# Altium schematic sheet Extra Analogue Inputs.SchDoc: Ravage - Extra Analogue Inputs
size A4; Address1: Drawn By:; Address2: Dan Visser; DocumentNumber: A; Revision: 0.1-alpha; SheetNumber: 7; SheetTotal: 16
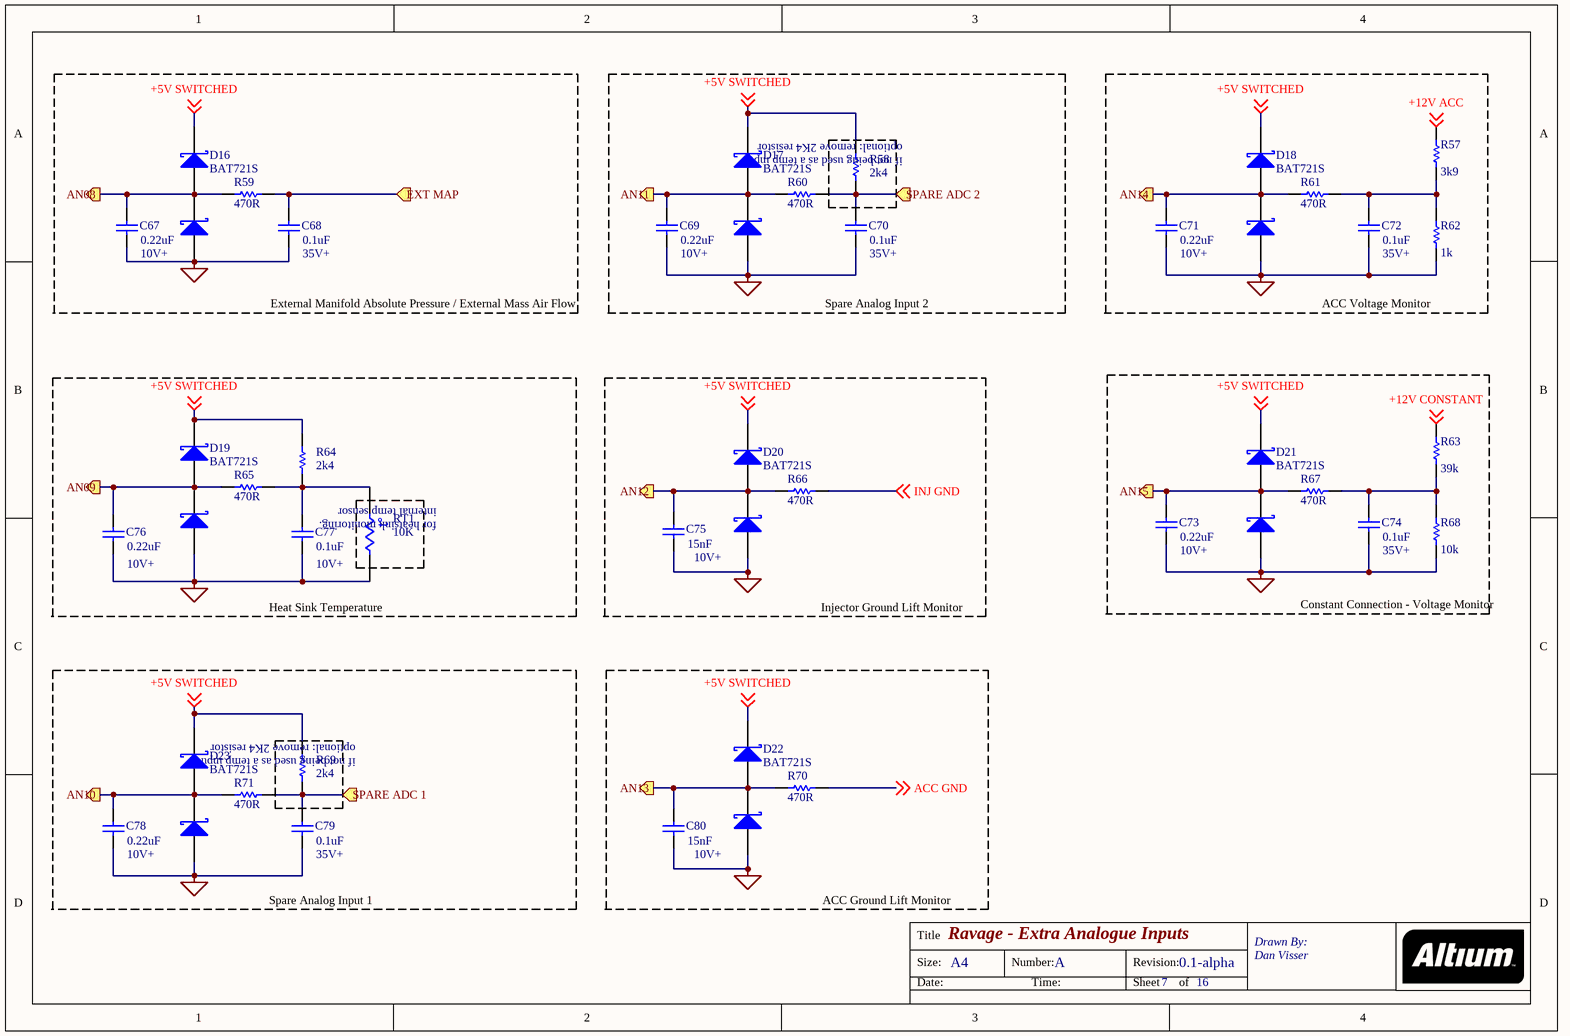
[diagram p0: Extra Analogue Inputs.SchDoc]

## Parts
C67  value 0.22uF  [RAD-0.3]
C68  value 0.1uF  [RAD-0.3]
C69  value 0.22uF  [RAD-0.3]
C70  value 0.1uF  [RAD-0.3]
C71  value 0.22uF  [RAD-0.3]
C72  value 0.1uF  [RAD-0.3]
C73  value 0.22uF  [RAD-0.3]
C74  value 0.1uF  [RAD-0.3]
C75  value 15nF  [RAD-0.3]
C76  value 0.22uF  [RAD-0.3]
C77  value 0.1uF  [RAD-0.3]
C78  value 0.22uF  [RAD-0.3]
C79  value 0.1uF  [RAD-0.3]
C80  value 15nF  [RAD-0.3]
D16  BAT721S
D17  BAT721S
D18  BAT721S
D19  BAT721S
D20  BAT721S
D21  BAT721S
D22  BAT721S
D23  BAT721S
R57  value 3k9  [AXIAL-0.3]
R58  value 2k4  [AXIAL-0.3]
R59  value 470R  [AXIAL-0.3]
R60  value 470R  [AXIAL-0.3]
R61  value 470R  [AXIAL-0.3]
R62  value 1k  [AXIAL-0.3]
R63  value 39k  [AXIAL-0.3]
R64  value 2k4  [AXIAL-0.3]
R65  value 470R  [AXIAL-0.3]
R66  value 470R  [AXIAL-0.3]
R67  value 470R  [AXIAL-0.3]
R68  value 10k  [AXIAL-0.3]
R69  value 2k4  [AXIAL-0.3]
R70  value 470R  [AXIAL-0.3]
R71  value 470R  [AXIAL-0.3]
RT1  10K  [6-0805_N]

## Ports
AN08 (out), AN09 (out), AN10 (out), AN11 (out), AN12 (out), AN13 (out), AN14 (out), AN15 (out), EXT MAP (in), SPARE ADC 1 (in), SPARE ADC 2 (in)

## Nets
NetC67_1: C67.1 C68.1 C69.1 C70.1 C71.1 C72.1 C73.1 C74.1 C75.1 C76.1 C77.1 C78.1 C79.1 C80.1 D16.1(A) D17.1(A) D18.1(A) D19.1(A) D20.1(A) D21.1(A) D22.1(A) D23.1(A) R62.1 R68.1 RT1.2
+5V SWITCHED: D16.2(K) D17.2(K) D18.2(K) D19.2(K) D20.2(K) D21.2(K) D22.2(K) D23.2(K) R58.1 R64.1 R69.1 ; off-sheet +5V SWITCHED
+12V ACC: R57.2 ; off-sheet +12V ACC
+12V CONSTANT: R63.2 ; off-sheet +12V CONSTANT
ACC GND: R70.2 ; off-sheet ACC GND
AN08: C67.2 D16.3(A2) R59.1 ; port AN08
AN09: C76.2 D19.3(A2) R65.1 ; port AN09
AN10: C78.2 D23.3(A2) R71.1 ; port AN10
AN11: C69.2 D17.3(A2) R60.1 ; port AN11
AN12: C75.2 D20.3(A2) R66.1 ; port AN12
AN13: C80.2 D22.3(A2) R70.1 ; port AN13
AN14: C71.2 D18.3(A2) R61.1 ; port AN14
AN15: C73.2 D21.3(A2) R67.1 ; port AN15
EXT MAP: C68.2 R59.2 ; port EXT MAP
INJ GND: R66.2 ; off-sheet INJ GND
SPARE ADC 1: C79.2 R69.2 R71.2 ; port SPARE ADC 1
SPARE ADC 2: C70.2 R58.2 R60.2 ; port SPARE ADC 2
NetC72_2: C72.2 R57.1 R61.2 R62.2
NetC74_2: C74.2 R63.1 R67.2 R68.2
NetC77_2: C77.2 R64.2 R65.2 RT1.1

## Notes on the sheet
- (near R58) optional: remove 2K4 resistor
- if not being used as a temp input.
- 10V+
- External Manifold Absolute Pressure / External Mass Air Flow
- (near C68) 35V+
- (near C69) 10V+
- Spare Analog Input 2
- (near C70) 35V+
- (near C71) 10V+
- ACC Voltage Monitor
- 35V+
- internal temp sensor
- for heatsink monitoring.
- (near C76) 10V+
- (near C73) 10V+
- Heat Sink Temperature
- Injector Ground Lift Monitor
- Constant Connection - Voltage Monitor
- optional: remove 2K4 resistor
- (near C78) 10V+
- Spare Analog Input 1
- (near C79) 35V+
- ACC Ground Lift Monitor
- Title
- Size:
- Date:
- A4
- Number:
- Time:
- Revision:
- Sheet
- of
- (in symbol Res Thermal) t°

## Library data of the parts
C67-C80 = Cap: Capacitor; Published: 8-Jun-2000; LatestRevisionDate: 17-Jul-2002; LatestRevisionNote: Re-released for DXP Platform.; PackageReference: RAD-0.3; Publisher: Altium Limited; PackageDescription: Radial Cap, Thru-Hole; 2 Leads; 0.3 in Pin Spacing
D16-D23 = BAT721S: DUAL SCHOTTKY DIODE
R57-R71 = Res1: Resistor; Published: 8-Jun-2000; LatestRevisionDate: 17-Jul-2002; LatestRevisionNote: Re-released for DXP Platform.; PackageReference: AXIAL-0.3; Publisher: Altium Limited; PackageDescription: Axial Device, Thru-Hole; 2 Leads; 0.3 in Pin Spacing
RT1 = Res Thermal: Thermistor; Published: 24-Mar-1999; LatestRevisionDate: 29-May-2009; LatestRevisionNote: IPC-7351 Footprint Added.; PackageVersion: Mar-2003; PackageReference: 6-0805; Publisher: Altium Limited; PackageDescription: Chip Resistor 0805 Case Size; Code_IPC: RESC2012